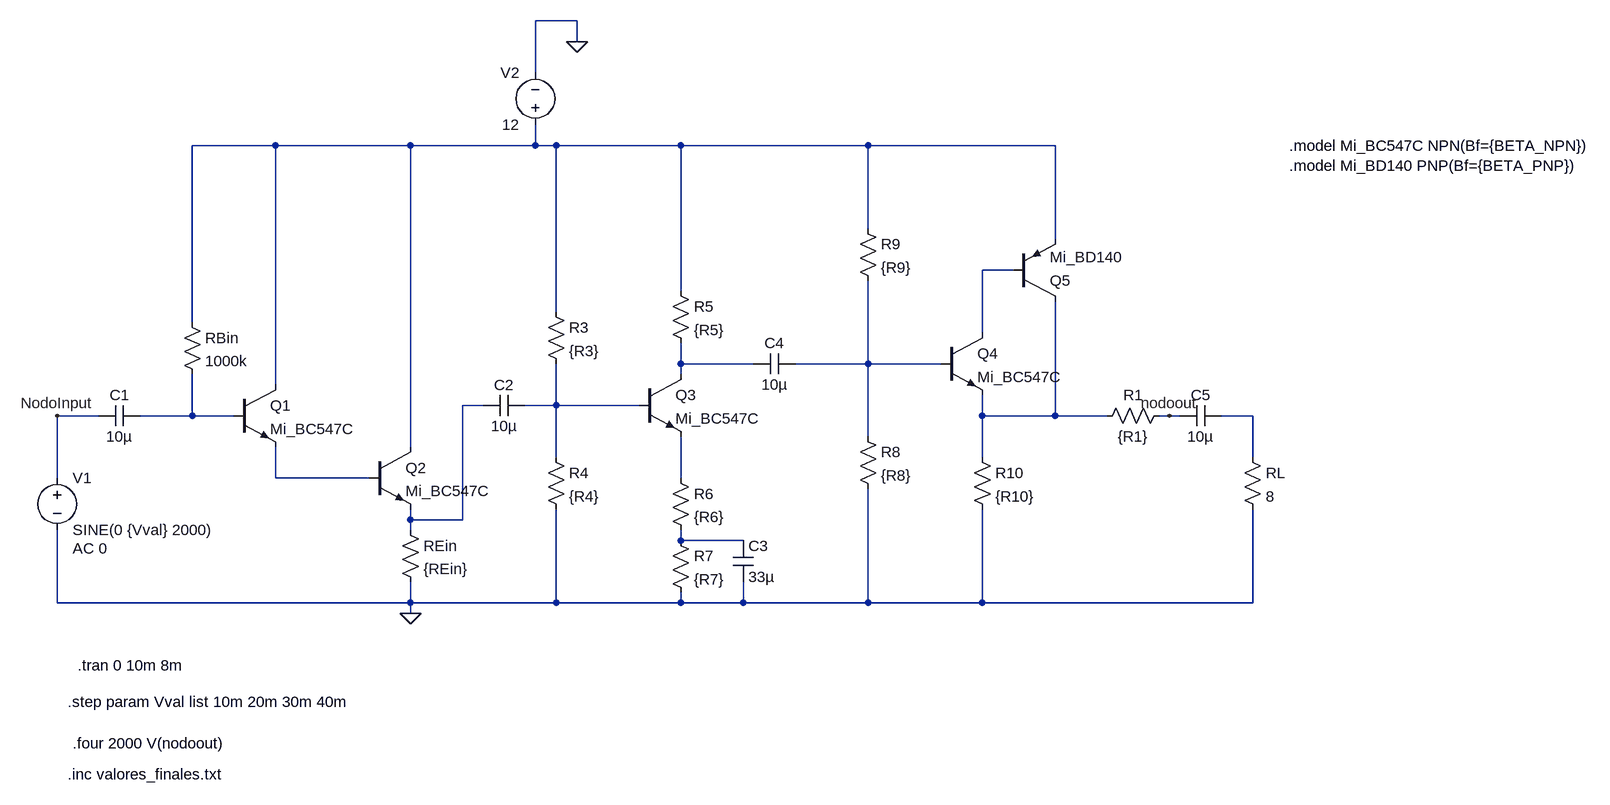
[diagram p0: schematic Amp2Etapas.asc]
Amp2Etapas.asc, the LTspice schematic file:
Version 4.1
SHEET 1 2240 680
WIRE 512 -544 448 -544
WIRE 512 -512 512 -544
WIRE 448 -464 448 -544
WIRE 48 -352 -80 -352
WIRE 256 -352 48 -352
WIRE 448 -352 448 -384
WIRE 448 -352 256 -352
WIRE 480 -352 448 -352
WIRE 672 -352 480 -352
WIRE 960 -352 672 -352
WIRE 1248 -352 960 -352
WIRE 960 -224 960 -352
WIRE 1248 -208 1248 -352
WIRE 1184 -160 1136 -160
WIRE 672 -128 672 -352
WIRE 480 -96 480 -352
WIRE -80 -80 -80 -352
WIRE 1136 -64 1136 -160
WIRE 672 -16 672 -48
WIRE 784 -16 672 -16
WIRE 960 -16 960 -144
WIRE 960 -16 848 -16
WIRE 1072 -16 960 -16
WIRE 672 0 672 -16
WIRE 48 16 48 -352
WIRE 368 48 336 48
WIRE 480 48 480 -16
WIRE 480 48 432 48
WIRE 608 48 480 48
WIRE -224 64 -288 64
WIRE -80 64 -80 0
WIRE -80 64 -160 64
WIRE -16 64 -80 64
WIRE 1136 64 1136 32
WIRE 1248 64 1248 -112
WIRE 1248 64 1136 64
WIRE 1328 64 1248 64
WIRE 1424 64 1408 64
WIRE 1440 64 1424 64
WIRE 1552 64 1504 64
WIRE 960 96 960 -16
WIRE 256 112 256 -352
WIRE 480 128 480 48
WIRE 1136 128 1136 64
WIRE 1552 128 1552 64
WIRE -288 160 -288 64
WIRE 48 160 48 112
WIRE 192 160 48 160
WIRE 672 160 672 96
WIRE 256 224 256 208
WIRE 336 224 336 48
WIRE 336 224 256 224
WIRE 256 240 256 224
WIRE 672 256 672 240
WIRE 768 256 672 256
WIRE -288 352 -288 240
WIRE 256 352 256 320
WIRE 256 352 -288 352
WIRE 480 352 480 208
WIRE 480 352 256 352
WIRE 672 352 672 336
WIRE 672 352 480 352
WIRE 768 352 768 320
WIRE 768 352 672 352
WIRE 960 352 960 176
WIRE 960 352 768 352
WIRE 1136 352 1136 208
WIRE 1136 352 960 352
WIRE 1552 352 1552 208
WIRE 1552 352 1136 352
WIRE 256 368 256 352
FLAG 256 368 0
FLAG 512 -512 0
FLAG -288 64 NodoInput
FLAG 1424 64 nodoout
SYMBOL npn -16 16 R0
SYMATTR InstName Q1
SYMATTR Value Mi_BC547C
SYMBOL res -96 -96 R0
SYMATTR InstName RBin
SYMATTR Value 1000k
SYMBOL cap -160 48 R90
WINDOW 0 0 32 VBottom 2
WINDOW 3 32 32 VTop 2
SYMATTR InstName C1
SYMATTR Value 10µ
SYMBOL npn 192 112 R0
SYMATTR InstName Q2
SYMATTR Value Mi_BC547C
SYMBOL res 240 224 R0
SYMATTR InstName REin
SYMATTR Value {REin}
SYMBOL cap 432 32 R90
WINDOW 0 0 32 VBottom 2
WINDOW 3 32 32 VTop 2
SYMATTR InstName C2
SYMATTR Value 10µ
SYMBOL res 464 -112 R0
SYMATTR InstName R3
SYMATTR Value {R3}
SYMBOL res 464 112 R0
SYMATTR InstName R4
SYMATTR Value {R4}
SYMBOL npn 608 0 R0
SYMATTR InstName Q3
SYMATTR Value Mi_BC547C
SYMBOL res 656 -144 R0
SYMATTR InstName R5
SYMATTR Value {R5}
SYMBOL res 656 144 R0
SYMATTR InstName R6
SYMATTR Value {R6}
SYMBOL res 656 240 R0
SYMATTR InstName R7
SYMATTR Value {R7}
SYMBOL cap 752 256 R0
SYMATTR InstName C3
SYMATTR Value 33µ
SYMBOL voltage 448 -368 R180
WINDOW 0 24 96 Left 2
WINDOW 3 24 16 Left 2
SYMATTR InstName V2
SYMATTR Value 12
SYMBOL cap 848 -32 R90
WINDOW 0 0 32 VBottom 2
WINDOW 3 32 32 VTop 2
SYMATTR InstName C4
SYMATTR Value 10µ
SYMBOL res 944 80 R0
SYMATTR InstName R8
SYMATTR Value {R8}
SYMBOL res 944 -240 R0
SYMATTR InstName R9
SYMATTR Value {R9}
SYMBOL npn 1072 -64 R0
SYMATTR InstName Q4
SYMATTR Value Mi_BC547C
SYMBOL res 1120 112 R0
SYMATTR InstName R10
SYMATTR Value {R10}
SYMBOL pnp 1184 -112 M180
SYMATTR InstName Q5
SYMATTR Value Mi_BD140
SYMBOL voltage -288 144 R0
WINDOW 123 24 124 Left 2
WINDOW 39 0 0 Left 0
SYMATTR Value2 AC 0
SYMATTR InstName V1
SYMATTR Value SINE(0 {Vval} 2000)
SYMBOL cap 1504 48 R90
WINDOW 0 0 32 VBottom 2
WINDOW 3 32 32 VTop 2
SYMATTR InstName C5
SYMATTR Value 10µ
SYMBOL res 1424 48 R90
WINDOW 0 0 56 VBottom 2
WINDOW 3 32 56 VTop 2
SYMATTR InstName R1
SYMATTR Value {R1}
SYMBOL res 1536 112 R0
SYMATTR InstName RL
SYMATTR Value 8
TEXT -272 504 Left 2 !.step param Vval list 10m 20m 30m 40m
TEXT -264 568 Left 2 !.four 2000 V(nodoout)
TEXT -272 616 Left 2 !.inc valores_finales.txt
TEXT 1608 -352 Left 2 !.model Mi_BC547C NPN(Bf={BETA_NPN})\n.model Mi_BD140 PNP(Bf={BETA_PNP})
TEXT -256 448 Left 2 !.tran 0 10m 8m

The netlist it stands for:
* Amp2Etapas.asc
Q1 N001 N007 N010 0 Mi_BC547C
RBin N001 N007 1000k
C1 N007 NodoInput 10µ
Q2 N001 N010 N005 0 Mi_BC547C
REin N005 0 {REin}
C2 N006 N005 10µ
R3 N001 N006 {R3}
R4 N006 0 {R4}
Q3 N003 N006 N011 0 Mi_BC547C
R5 N001 N003 {R5}
R6 N011 N012 {R6}
R7 N012 0 {R7}
C3 N012 0 33µ
V2 N001 0 12
C4 N004 N003 10µ
R8 N004 0 {R8}
R9 N001 N004 {R9}
Q4 N002 N004 N008 0 Mi_BC547C
R10 N008 0 {R10}
Q5 N008 N002 N001 0 Mi_BD140
V1 NodoInput 0 SINE(0 {Vval} 2000) AC 0
C5 N009 nodoout 10µ
R1 nodoout N008 {R1}
RL N009 0 8
.model NPN NPN
.model PNP PNP
.lib standard.bjt
.step param Vval list 10m 20m 30m 40m
.four 2000 V(nodoout)
.inc valores_finales.txt
.model Mi_BC547C NPN(Bf={BETA_NPN})
.model Mi_BD140 PNP(Bf={BETA_PNP})
.tran 0 10m 8m
.backanno
.end